# EAGLE design Qwiic_Iridium_9603N (EAGLE 9.6.2)
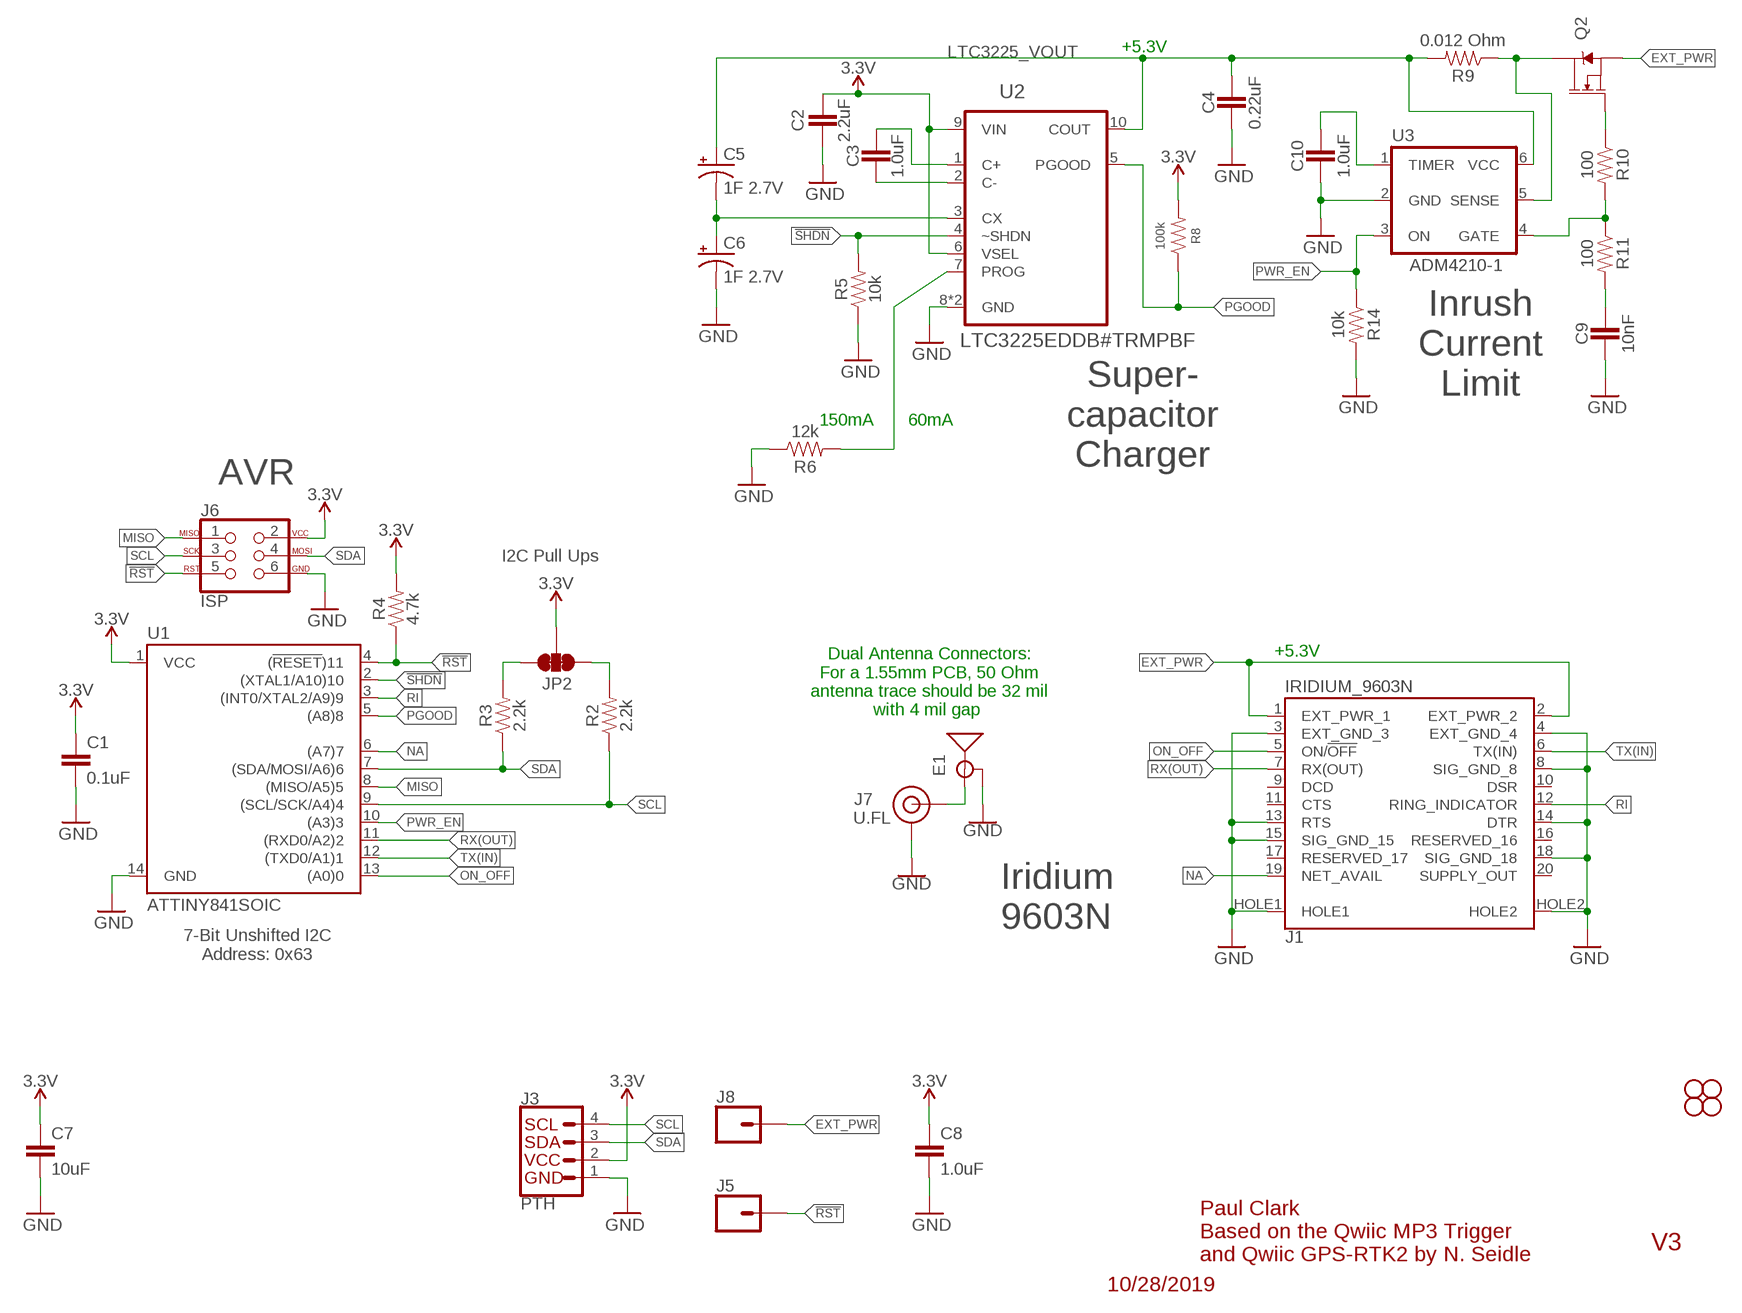
[diagram p0: schematic, sheet 1]

## Parts
C1  0.1uF  0.1UF-0603-25V-5%  [0603]
C2  2.2uF  2.2UF-0603-10V-20%  [0603]
C3  1.0uF  1.0UF-0603-16V-10%-X7R  [0603]
C4  0.22uF  0.22UF-0603-25V-10%  [0603]
C5  1F 2.7V  1F-2.7V(PTH)CPOL-RADIAL-1H-2.7V  [CPOL-RADIAL-1F-2.7V]
C6  1F 2.7V  1F-2.7V(PTH)CPOL-RADIAL-1H-2.7V  [CPOL-RADIAL-1F-2.7V]
C7  10uF  10UF-0603-6.3V-20%  [0603]
C8  1.0uF  1.0UF-0603-16V-10%-X7R  [0603]
C9  10nF  10NF-0603-50V-10%  [0603]
C10  1.0uF  1.0UF-0603-16V-10%-X7R  [0603]
E1  ANTENNA-GROUNDEDEDGE_SMA  [SMA-EDGE]
J1  IRIDIUM_9603N  [IRIDIUM_9603N]
J3  PTH  I2C_STANDARDJS-1MM  [1X04_1MM_RA]
J5  CONN_01PTH_NO_SILK_YES_STOP  [1X01_NO_SILK]
J6  ISP  AVR_SPI_PROG_3X2TESTPOINTS  [2X3_TEST_POINTS]
J7  U.FL  U.FL2PIN  [U.FL]
J8  CONN_01PTH_NO_SILK_YES_STOP  [1X01_NO_SILK]
JP2  JUMPER-SMT_3_2-NC_TRACE_SILK  [SMT-JUMPER_3_2-NC_TRACE_SILK]
JP3  STAND-OFF  [STAND-OFF]
JP4  STAND-OFF  [STAND-OFF]
JP9  STAND-OFF  [STAND-OFF]
JP10  STAND-OFF  [STAND-OFF]
Q2  5.8A/30V/35mΩ  MOSFET-NCH-AO3404A  [SOT23-3]
R2  2.2k  2.2KOHM-0603-1/10W-1%  [0603]
R3  2.2k  2.2KOHM-0603-1/10W-1%  [0603]
R4  4.7k  4.7KOHM-0603-1/10W-1%  [0603]
R5  10k  10KOHM-0603-1/10W-1%  [0603]
R6  12k  12KOHM-0603-1/10W-1%  [0603]
R8  100k  100KOHM-0603-1/10W-1%  [0603]
R9  0.012 Ohm  RESISTOR0603  [0603]
R10  100  100OHM-0603-1/10W-1%  [0603]
R11  100  100OHM-0603-1/10W-1%  [0603]
R14  10k  10KOHM-0603-1/10W-1%  [0603]
U1  ATTINY841SOIC  [ATTINY841]
U2  LTC3225EDDB#TRMPBF  LTC3225EDDB-TRMPBFDFN300X200-10L  [DFN300X200-10L]
U3  ADM4210-1  [TSOT6]

## Nets
3.3V [3.3V]: C1.1 C2.1 C7.1 C8.1 J3.2(VCC) J6.2 JP2.2 R4.2 R8.2 U1.1(VCC) U2.6(VSEL) U2.9(VIN)
!RST: J5.1 J6.5 R4.1 U1.4((!RESET!)11)
!SHDN: R5.2 U1.2((XTAL1/A10)10) U2.4(~SHDN)
EXT_PWR: J1.1(EXT_PWR_1) J1.2(EXT_PWR_2) J8.1 Q2.2(S)
GND: C1.2 C2.2 C4.2 C6.- C7.2 C8.2 C9.2 C10.2 E1.GND@0(GND) E1.GND@1(GND) E1.GND@2(GND) E1.GND@3(GND) J1.3(EXT_GND_3) J1.4(EXT_GND_4) J1.8(SIG_GND_8) J1.13(RTS) J1.14(DTR) J1.15(SIG_GND_15) J1.18(SIG_GND_18) J1.HOLE1 J1.HOLE2 J3.1(GND) J6.6 J7.1(GND) J7.2(GND) R5.1 R6.1 R14.2 U1.14(GND) U2.8(GND) U2.11(GND) U3.2(GND)
LTC3225_VOUT: C4.1 C5.+ R9.2 U2.10(COUT) U3.6(VCC)
MISO: J6.1 U1.8((MISO/A5)5)
N$1: C5.- C6.+ U2.3(CX)
N$2: R6.2 U2.7(PROG)
N$7: E1.SIG(SIGNAL) J7.FEED(SIGNAL)
N$8: Q2.3(D) R9.1 U3.5(SENSE)
N$9: C3.2 U2.2(C-)
N$10: C3.1 U2.1(C+)
N$12: Q2.1(G) R10.1
N$13: R10.2 R11.1 U3.4(GATE)
N$14: C9.1 R11.2
N$15: C10.1 U3.1(TIMER)
NA: J1.19(NET_AVAIL) U1.6((A7)7)
ON_OFF: J1.5(ON/!OFF!) U1.13((A0)0)
PGOOD: R8.1 U1.5((A8)8) U2.5(PGOOD)
PWR_EN: R14.1 U1.10((A3)3) U3.3(ON)
RI: J1.12(RING_INDICATOR) U1.3((INT0/XTAL2/A9)9)
RX(OUT): J1.7(RX(OUT)) U1.11((RXD0/A2)2)
SCL: J3.4(SCL) J6.3 R2.1 U1.9((SCL/SCK/A4)4)
SCL_PU1: JP2.1 R2.2
SDA: J3.3(SDA) J6.4 R3.1 U1.7((SDA/MOSI/A6)6)
SDA_PU1: JP2.3 R3.2
TX(IN): J1.6(TX(IN)) U1.12((TXD0/A1)1)
Unconnected: J1.9(DCD) J1.10(DSR) J1.11(CTS) J1.16(RESERVED_16) J1.17(RESERVED_17) J1.20(SUPPLY_OUT)

## Notes on the sheet
- +5.3V
- Inrush
  Current
  Limit
- 150mA | 60mA
- Super-
  capacitor
  Charger
- AVR
- I2C Pull Ups
- +5.3V
- Dual Antenna Connectors:
  For a 1.55mm PCB, 50 Ohm
  antenna trace should be 32 mil
  with 4 mil gap
- Iridium
  9603N
- 7-Bit Unshifted I2C
  Address: 0x63
- V3
- Paul Clark
  Based on the Qwiic MP3 Trigger
  and Qwiic GPS-RTK2 by N. Seidle
- 10/28/2019

## Library data of the parts
C1 = SparkFun-Capacitors:0.1UF: 0.1µF ceramic capacitors A capacitor is a passive two-terminal electrical component used to store electrical energy temporarily in an electric field.; PROD_ID: CAP-08604
C2 = SparkFun-Capacitors:2.2UF: 2.2µF ceramic capacitors A capacitor is a passive two-terminal electrical component used to store electrical energy temporarily in an electric field.; PROD_ID: CAP-07888
C3 C8 C10 = SparkFun-Capacitors:1.0UF: 1µF ceramic capacitors A capacitor is a passive two-terminal electrical component used to store electrical energy temporarily in an electric field.; PROD_ID: CAP-13930
C4 = SparkFun-Capacitors:0.22UF: 0.22µF ceramic capacitors A capacitor is a passive two-terminal electrical component used to store electrical energy temporarily in an electric field.; PROD_ID: CAP-07822
C5 C6 = SparkFun-Capacitors:1F-2.7V(PTH): CAP-08070
C7 = SparkFun-Capacitors:10UF: 10.0µF ceramic capacitors A capacitor is a passive two-terminal electrical component used to store electrical energy temporarily in an electric field.; PROD_ID: CAP-11015
C9 = SparkFun-Capacitors:10NF: 0.01uF/10nF/10,000pF ceramic capacitors A capacitor is a passive two-terminal electrical component used to store electrical energy temporarily in an electric field. CAP-09321; PROD_ID: CAP-00867
E1 = SparkFun-RF:ANTENNA-GROUNDED: Antenna w/ Ground Connection 2.4GHz antennae with signal and ground terminals. TRACE_ANTENNA_2.4GHZ_15.2MM - Meander Trace antenna 15.2 x 5.7mm footprint Based on layout from TI app note AN043 <http://www.ti.com/lit/an/swra117d/swra117d.pdf>. TRACE_ANTENNA_2.4GHZ_25.7MM - Inverted F trace antenna 25.7 x 7.5 mm footprint. Based on layout from TI design note DN0007 <http://www.ti.com/lit/an/swru120b/swru120b.pdf>.; PROD_ID: CONN-08289
J1 = Qwiic_Iridium_9603N:IRIDIUM_9603N: Iridium 9603N with two McMaster 95117A411 press-fit nuts
J3 = SparkX:I2C_STANDARD: SparkFun I2C Standard Pinout Header SparkFun has standardized on a pinout for all I2C based sensor breakouts. This pinout allows I2C boards to be plugged directly into the headers on Arduino Uno compatible boards, and to be daisy chained easily. Example SparkFun Products: SparkFun Atmospheric Sensor Breakout - BME280 <https://www.sparkfun.com/products/13676> SparkFun Altitude/Pressure Sensor Breakout - MPL3115A2 <https://www.sparkfun.com/products/11084> SparkFun TOF Range Finder Sensor - VL6180 <https://www.sparkfun.com/products/12785>
J5 J8 = SparkFun-Connectors:CONN_01: Single connection point. Often used as Generic Header-pin footprint for 0.1 inch spaced/style header connections On any of the 0.1 inch spaced packages, you can populate with these: Break Away Headers - Straight <https://www.sparkfun.com/products/116> (PRT-00116) Break Away Male Headers - Right Angle <https://www.sparkfun.com/products/553> (PRT-00553) Female Headers <https://www.sparkfun.com/products/115> (PRT-00115) Break Away Headers - Machine Pin <https://www.sparkfun.com/products/117> (PRT-00117) Break Away Female Headers - Swiss Machine Pin <https://www.sparkfun.com/products/743> (PRT-00743) This device is also useful as a general connection point to wire up your design to another part of your project. Our various solder wires solder well into these plated through hole pads. Hook-Up Wire - Assortment (Stranded, 22 AWG) <https://www.sparkfun.com/products/11375> (PRT-11375) Hook-Up Wire - Assortment (Solid Core, 22 AWG) <https://www.sparkfun.com/products/11367> (PRT-11367) View the entire wire category on our website here <https://www.sparkfun.com/categories/141> Special notes: SMTSO-256-ET is a "flush mount" nut for a 4-40 screw. We mostly use this on specialty testbeds; it is a nice way to connect hardware to your PCB at an adjustable hieght. Also note, the SNAP packages are for using a snappable style connector. We sell a baggie of snaps and they are also used on two LilyPad designs: Snap Assortment - 30 pack (male and female) <https://www.sparkfun.com/products/11347> (DEV-11347) LilyPad Arduino SimpleSnap <https://www.sparkfun.com/products/10941> (DEV-10941) LilyPad SimpleSnap Protoboard <https://www.sparkfun.com/products/10940> (DEV-10940)
J6 = SparkFun-Connectors:AVR_SPI_PROG_3X2: AVR ISP 6 Pin This is the reduced ISP connector for AVR programming. Common on Arduino. This footprint will take up less PCB space and can be used with a 10-pin to 6-pin adapter such as SKU: BOB-08508 **Special note about "TEST_POINT" package. The stop mask is on the top side, so if you want your programming test points to be on the bottom of your board, make sure to place this package on the bottom side of the board. This also ensure that the orientation to program from the bottom side will be correct. SparkFun Products: SparkFun ISP Pogo Adapter <https://www.sparkfun.com/products/11591> - NS Tiny AVR Programmer <https://www.sparkfun.com/products/11801> -PTH
J7 = SparkFun-Connectors:U.FL2PIN: SMD Antenna Connector - U.FL 2mm height, 3.0mm x 3.0mm receptacle size. SparkFun Products: SparkFun WiFi Shield - ESP8266 <https://www.sparkfun.com/products/13287> SparkFun ESP8266 Thing <https://www.sparkfun.com/products/13231> SparkFun MiniGen - Pro Mini Signal Generator Shield <https://www.sparkfun.com/products/11420>; PROD_ID: CONN-09193; SF_ID: WRL-09144
JP2 = SparkFun-Jumpers:JUMPER-SMT_3_2-NC_TRACE: Normally closed trace jumper (2 of 2 connections) This jumper has a trace between all three pads so they are normally closed (NC). Use a razor knife to open the connection(s). For best results follow the IPC guidelines for cutting traces: Cutout at least 0.063 mm (0.005 in). Remove all loose material to clean up the cut area. Seal the cut with an approved epoxy. Reapply solder to reclose the connection(s).
JP3 JP4 JP9 JP10 = SparkFun-Hardware:STAND-OFF: Stand Off Drill holes for mechanically mounting via screws, standoffs, etc. Note: Use the keepout ring to avoid running the screw head into surrounding components. Variant Overviews STAND-OFF - Mechanical footprint for a #4 phillips button head screw. STAND-OFF-TIGHT - Mechanical footprint for a #4 phillips button head screw, Example SparkFun Products Screw - Phillips Head (1/4", 4-40, 10 pack) <https://www.sparkfun.com/products/10453> (PRT-10453) Screw - Phillips Head (1/2", 4-40, 10 pack) <https://www.sparkfun.com/products/10452> (PRT-10452) Screw - Phillips Head (3/4", 4-40, 10 pack) <https://www.sparkfun.com/products/10451> (PRT-10451) Screw - Phillips Head (1", 4-40, 10 pack) <https://www.sparkfun.com/products/10450> (PRT-10450)
Q2 = SparkFun-DiscreteSemi:MOSFET-NCH: N-channel MOSFETs Voltage controlled devices that allow control of high current outputs. SparkFun Products: SparkFun OpenScale <https://www.sparkfun.com/products/13261> SparkFun Digital Sandbox <https://www.sparkfun.com/products/12651> SparkFun Monster Moto Shield <https://www.sparkfun.com/products/10182> SparkFun MOSFET Power Controller <https://www.sparkfun.com/products/11214>; PROD_ID: TRANS-12988
R2 R3 = SparkFun-Resistors:2.2KOHM: 2.2kΩ resistor A resistor is a passive two-terminal electrical component that implements electrical resistance as a circuit element. Resistors act to reduce current flow, and, at the same time, act to lower voltage levels within circuits. - Wikipedia; PROD_ID: RES-08272
R4 = SparkFun-Resistors:4.7KOHM: 4.7kΩ resistor A resistor is a passive two-terminal electrical component that implements electrical resistance as a circuit element. Resistors act to reduce current flow, and, at the same time, act to lower voltage levels within circuits. - Wikipedia; PROD_ID: RES-07857
R5 R14 = SparkFun-Resistors:10KOHM: 10kΩ resistor A resistor is a passive two-terminal electrical component that implements electrical resistance as a circuit element. Resistors act to reduce current flow, and, at the same time, act to lower voltage levels within circuits. - Wikipedia; PROD_ID: RES-00824
R6 = SparkFun-Resistors:12KOHM: 12kΩ resistor A resistor is a passive two-terminal electrical component that implements electrical resistance as a circuit element. Resistors act to reduce current flow, and, at the same time, act to lower voltage levels within circuits. - Wikipedia; PROD_ID: RES-10327
R8 = SparkFun-Resistors:100KOHM: 100kΩ resistor A resistor is a passive two-terminal electrical component that implements electrical resistance as a circuit element. Resistors act to reduce current flow, and, at the same time, act to lower voltage levels within circuits. - Wikipedia; PROD_ID: RES-07828
R9 = SparkFun-Resistors:RESISTOR: Generic Resistor Package
R10 R11 = SparkFun-Resistors:100OHM: 100Ω resistor A resistor is a passive two-terminal electrical component that implements electrical resistance as a circuit element. Resistors act to reduce current flow, and, at the same time, act to lower voltage levels within circuits. - Wikipedia; PROD_ID: RES-07863
U1 = Qwiic_Iridium_9603N:ATTINY841: The high-performance Microchip picoPower 8-bit AVR RISC-based microcontroller combines 8KB ISP flash memory, 512-Byte EEPROM, 512B SRAM, 12 general purpose I/O lines, 32 general purpose working registers, an 8-bit timer/counter with two PWM channels,??two 16-bit timer/counters with two PWM channels, internal and external interrupts, an 12-channel 10-bit A/D converter, 2 On-chip analog comparators, 2 full duplex USARTs with Start Frame wake up from power down, master/slave SPI serial interface, slave I2C serial interface, programmable gain stage (1x, 20x, and 100x) for 12 differential ADC channel pairs, programmable watchdog timer with internal oscillator, internal calibrated oscillator, and four software selectable power saving modes. The device operates between 1.7-5.5 volts.
U2 = Qwiic_Iridium_9603N:LTC3225EDDB-TRMPBF: 150mA Supercapacitor Charger
U3 = Qwiic_Iridium_9603N:ADM4210

## Net classes
1 3.3V: width 0.305 mm

## Board
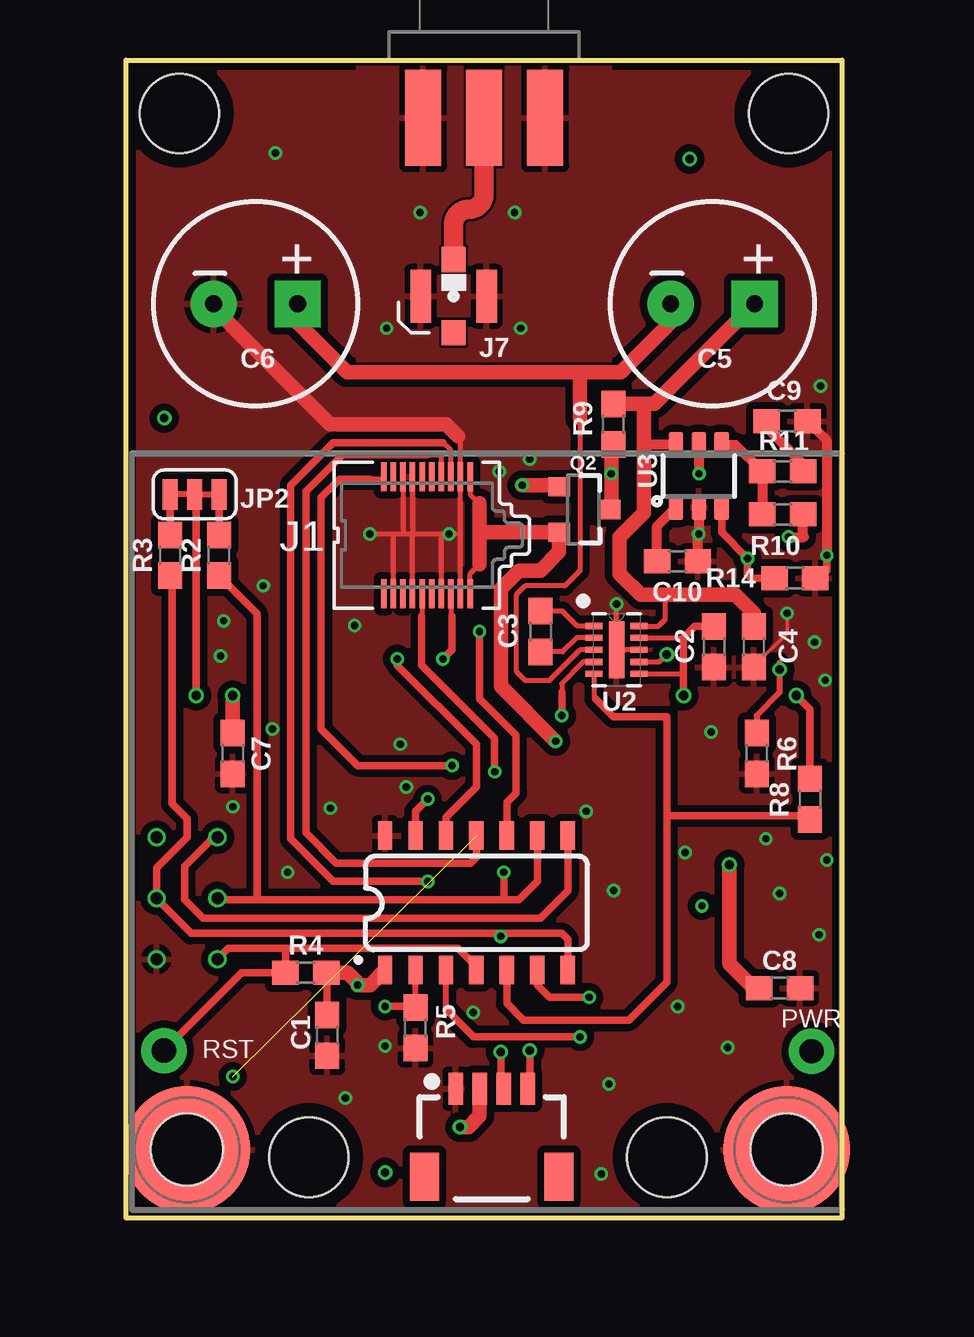
[diagram p1: board, top side]
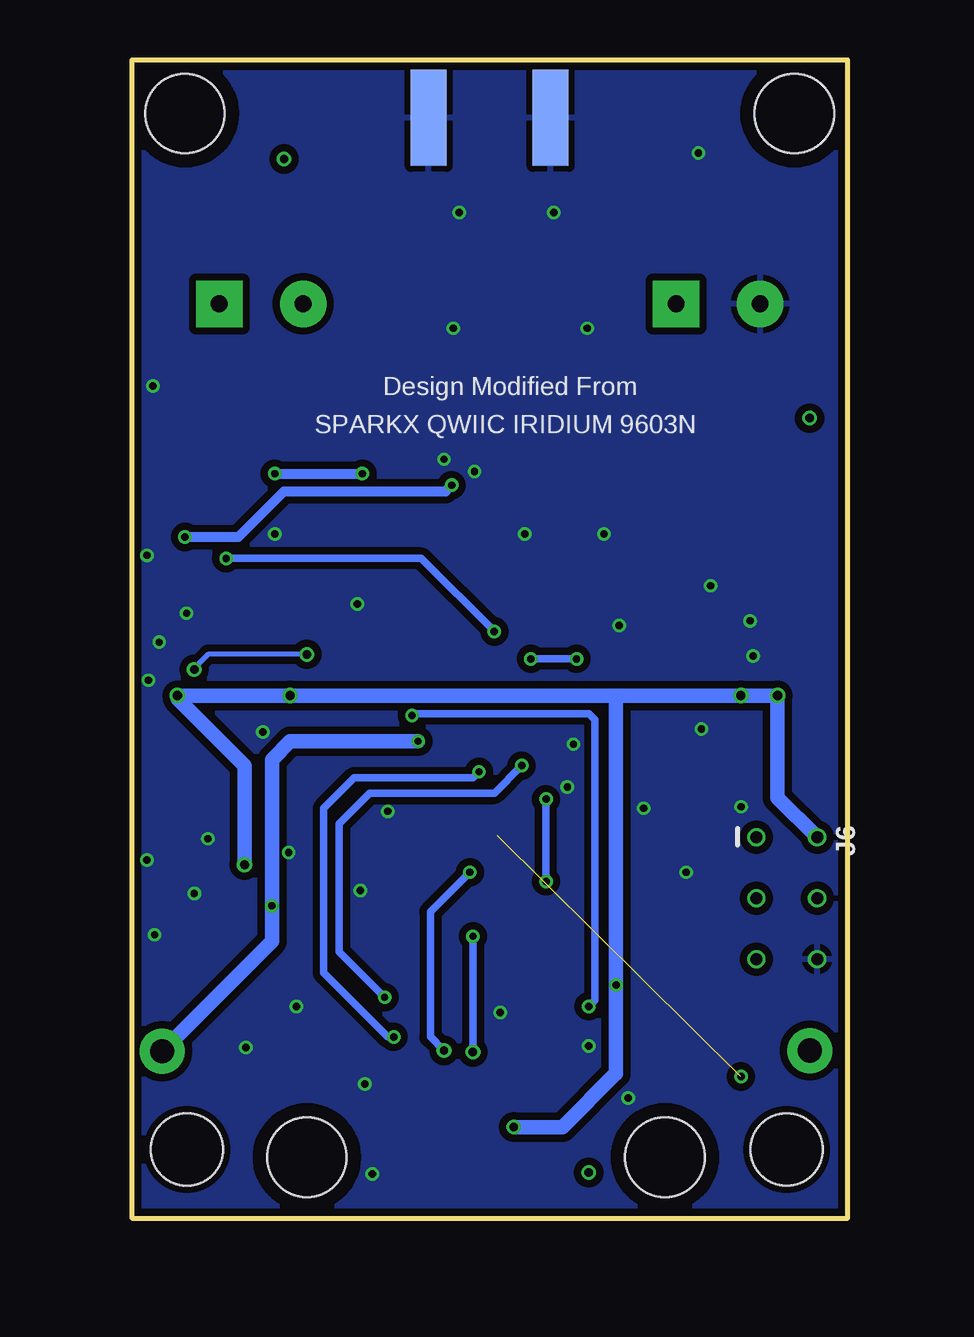
[diagram p2: board, bottom side, seen from below]

Size 29.85 x 48.26 mm. Coordinates in mm from the lower left corner, seen from the top.
Outline: 0,0 0,48.26 29.85,48.26 29.85,0 0,0
Copper layers (1*16): Top 0.035mm / dielectric 1.5mm / Bottom 0.035mm
Design rules "SparkFun-2-layer-FAB-LIMIT": minimum track width 4mil, minimum drill 6mil, track to track 4mil, track to pad 4mil, pad to pad 4mil, via to via 4mil, smd to smd 4mil, copper to edge 4mil, drill to drill 4mil, minimum pad ring 5mil, minimum via ring 5mil, stop-mask expansion 4mil, vias tented up to drill 25mil, thermal gap 10mil

### Footprints (pad centres in the part's own frame; a part is rotated, then mirrored left to right if it is on the bottom)
0603 = smd 1.1 x 1: 1 -0.85,0; 2 0.85,0
CPOL-RADIAL-1F-2.7V = drill 0.7 pad 1.93 square: + 1.75,0 | drill 0.7 pad 1.93: - -1.75,0
SMA-EDGE = smd 1.5 x 4: GND@0 -2.54,0; GND@1 2.54,0; SIG 0,0 | smd 1.5 x 4 bottom: GND@2 -2.54,0; GND@3 2.54,0
IRIDIUM_9603N = smd 0.23 x 1.2: 1 11.8,28.035; 2 11.8,23.165; 3 11.4,28.035; 4 11.4,23.165; 5 11,28.035; 6 11,23.165; 7 10.6,28.035; 8 10.6,23.165; 9 10.2,28.035; 10 10.2,23.165; 11 9.8,28.035; 12 9.8,23.165; 13 9.4,28.035; 14 9.4,23.165; 15 9,28.035; 16 9,23.165; 17 8.6,28.035; 18 8.6,23.165; 19 8.2,28.035; 20 8.2,23.165 | smd 5.3 x 5.3: HOLE1 0,0; HOLE2 25,0 | hole 3: 0,0; 25,0
1X04_1MM_RA = smd 0.6 x 1.35: 1 -1.5,0; 2 -0.5,0; 3 0.5,0; 4 1.5,0 | smd 1.2 x 2: NC1 2.8,-3.675; NC2 -2.8,-3.675
1X01_NO_SILK = drill 1.016 pad 1.88: 1 0,0
2X3_TEST_POINTS = drill 0.508: 1 -2.54,-1.27; 2 -2.54,1.27; 3 0,-1.27; 4 0,1.27; 5 2.54,-1.27; 6 2.54,1.27
U.FL = smd 2.2 x 0.85: 1 0,1.375; 2 0,-1.375 | smd 1.05 x 1: FEED 1.525,0; NC -1.525,0
SMT-JUMPER_3_2-NC_TRACE_SILK = smd 0.635 x 1.27: 1 -1.016,0; 2 0,0; 3 1.016,0
STAND-OFF = hole 3.302: 0,0
SOT23-3 = smd 0.8 x 0.9: 1 -0.95,-1; 2 0.95,-1; 3 0,1.1
ATTINY841 = smd 0.6 x 1.2: 1 -3.175,-2.8; 2 -1.905,-2.8; 3 -0.635,-2.8; 4 0.635,-2.8; 5 1.905,-2.8; 6 3.175,-2.8; 7 4.445,-2.8; 8 4.445,2.8; 9 3.175,2.8; 10 1.905,2.8; 11 0.635,2.8; 12 -0.635,2.8; 13 -1.905,2.8; 14 -3.175,2.8
DFN300X200-10L = smd 0.711 x 0.254: 1 -0.94,0.991; 2 -0.94,0.508; 3 -0.94,0; 4 -0.94,-0.508; 5 -0.94,-0.991; 6 0.94,-0.991; 7 0.94,-0.508; 8 0.94,0; 9 0.94,0.508; 10 0.94,0.991 | smd 0.635 x 2.388: 11 0,0
TSOT6 = smd 0.6 x 1.05: 1 -0.95,-1.3; 2 0,-1.3; 3 0.95,-1.3; 4 0.95,1.3; 5 0,1.3; 6 -0.95,1.3

### Placement (x,y rotation side)
C1  8.38,7.62 270 top
C2  24.51,23.81 270 top
C3  17.27,24.45 270 top
C4  26.16,23.81 270 top
C5  24.45,38.1 0 top
C6  5.4,38.1 0 top
C7  4.45,19.37 270 top
C8  27.24,9.59 0 top
C9  27.56,33.21 0 top
C10  22.99,27.37 0 top
E1  14.92,45.85 0 top
J1  2.54,2.86 0 top
J3  15.24,5.4 0 top
J5  1.57,6.99 0 top
J6  2.54,13.34 270 bottom
J7  13.65,38.42 90 top
J8  28.57,6.96 0 top
JP2  2.86,30.16 180 top
JP3  2.22,46.04 0 top
JP4  27.62,46.04 0 top
JP9  22.54,2.54 0 top
JP10  7.62,2.54 0 top
Q2  19.05,29.53 270 top
R2  3.87,27.62 90 top
R3  1.84,27.62 90 top
R4  7.49,10.22 0 top
R5  12.07,7.94 90 top
R6  26.29,19.37 90 top
R8  28.51,17.46 90 top
R9  20.32,33.08 90 top
R10  27.37,29.34 180 top
R11  27.37,31.12 0 top
R14  27.88,26.67 0 top
U1  13.97,13.14 0 top
U2  20.45,23.69 0 top
U3  23.88,30.92 0 top

### Tracks (layer width: path | path; a pad name or v marks a point on that pad's centre or on a via)
3.3V  (via drill 0.3, 0.35 pad 0.61, 0.38)
  Top 0.203: U2.9 23.24,24.19 | U2.6 23.22,22.69
  Top 0.305: C1.1 8.38,10.18 R4.2 | JP2.2 2.91,30.11 2.91,21.79 v2.92,21.78 | C2.1 23.71,24.66 23.24,24.19 23.24,22.67 | 23.24,22.67 v23.24,21.78 | 23.22,22.69 23.24,22.67 | R8.2 28.51,21.21 v27.94,21.78 | 25.07,14.73 v25.15,14.73
  Top 0.61: R4.2 9.23,10.22 9.65,9.8 v9.65,9.72 10.17,9.72 U1.1 | C7.1 v4.45,21.78 | C8.1 26.16,9.59 25.15,10.6 v25.15,14.73 | v13.92,3.8 14.27,3.8 14.74,4.26 J3.2
  Bottom 0.61: v25.15,14.73 25.15,18.86 27.94,21.65 v27.94,21.78 v23.24,21.78 9.65,21.78 | 9.65,21.78 v4.45,21.78 v2.92,21.78 2.92,17.53 J6.2 | 9.65,21.78 v9.65,9.72 9.65,6.03 9.66,6.03 11.89,3.8 v13.92,3.8
!RST
  Top 0.305: 6.64,11.24 4.25,11.24 J6.5 | 6.64,11.24 R4.1 4.81,10.22 J5.1 | 6.64,11.24 13.84,11.24 14.61,10.48 U1.4
!SHDN  (via drill 0.3)
  Top 0.203: U2.4 19.05,23.18 18.16,22.29 18.16,21.91
  Top 0.254: R5.2 U1.2
  Top 0.305: R5.2 12.03,8.83 v10.79,8.83 | v18.16,20.95 18.16,21.91
  Bottom 0.305: v10.79,8.83 10.54,9.08 10.54,20.76 10.79,21.02 18.09,21.02 v18.16,20.95
EXT_PWR  (via drill 0.3)
  Top 0.203: 14.34,30.17 14.73,29.78 | 14.73,27.24 14.34,26.85 14.34,26.12 J1.2 | J1.1 14.34,30.17 | 14.34,30.17
  Top 0.61: 14.73,29.78 14.73,28.51 | 14.73,28.51 14.73,27.24 | v17.91,19.88 15.62,22.16 15.62,26.23 16.38,26.99 17.27,26.99 18.05,27.77 Q2.2 14.8,28.58 14.73,28.51
  Bottom 0.61: v17.91,19.88 23.24,19.88 24,19.11 v24,13.02 24,11.53 J8.1
GND  (via drill 0.3)
  Top 0.152: v27.56,25.21 27.56,24.38 26.35,23.18
  Top 0.203: 13.84,32.58 13.94,32.48 J1.3 13.94,28.51 | J1.4 13.94,28.51 | 13.94,28.51 v13.46,28.51 13.21,28.51 | v10.16,28.51 11.18,28.51 | 11.18,28.51 11.56,28.51 | 11.56,28.51 11.94,28.51 | 11.94,28.51 13.21,28.51 | J1.15 11.54,28.53 11.56,28.51 | J1.13 11.94,28.51 | J1.18 11.14,28.48 11.18,28.51 | J1.14 11.94,28.51 | J1.8 13.14,28.44 13.21,28.51 | U2.8 U2.11 v20.45,25.59
  Top 0.305: v29.21,27.62 29.21,26.99 28.89,26.67 R14.2 | C4.2 26.16,22.99 26.35,23.18
  Top 0.406: U3.2 v23.88,28.51 23.84,28.47 C10.2 | C9.2 29.21,32.41 v29.21,27.62
  Top 0.61: 13.84,32.58 13.34,33.08 8.51,33.08 3.65,37.95 C6.- 3.56,38.01
  other vias: 10.79,7.18 20.13,5.59 4.45,17.14 4.06,24.89 28.7,24 26.67,15.81 25.08,7.11 8.51,17.08 11.68,17.97 6.73,14.41 12.26,41.91 16.19,41.91 16.45,37.08 15.56,31.12 11.43,19.75 9.52,24.7 5.71,26.35 23.3,15.24 22.99,8.83 19.81,1.84 9.14,5.02 29.15,22.42 3.94,23.43 10.86,37.08 16.83,31.62 6.1,20.38 24.38,20.26 14.48,8.57 19.18,16.95 20.32,13.65 6.22,44.39 28.96,34.67 29.21,14.92 28.89,11.81 27.24,13.53
  pour Bottom (isolate 0.305, rank 2): 0,0 0,48.26 29.85,48.26 29.85,0
  pour Top (isolate 0.305, rank 2): 0,0 0,48.26 29.85,48.26 29.85,0
  pour Top (isolate 0.102): 9.72,35.56 9.72,49.21 20.13,49.21 20.13,35.56
LTC3225_VOUT
  Top 0.203: U2.10 22.2,24.68 22.48,24.96 22.48,25.97
  Top 0.406: U3.6 21.62,32.22 21.59,32.19
  Top 0.61: 26.86,37.44 C5.+ 22.03,33.93 21.59,33.93 | C4.1 26.16,25.21 25.4,25.97 22.48,25.97 21.46,25.97 20.57,26.86 20.57,28.38 21.59,29.4 21.59,32.19 21.59,33.93 | 21.59,33.93 R9.2
MISO
  Top 0.305: J6.1 3.66,15.87 2.45,14.67 2.45,13.27 3.21,12.51 17.27,12.51 18.41,13.65 U1.8
N$1
  Top 0.203: U2.3 18.92,23.69 17.65,22.42 16.64,22.42 16.26,22.8 16.26,25.97 16.64,26.35 18.29,26.35 18.92,26.99 18.92,33.34 18.92,33.4
  Top 0.61: C5.- 22.7,37.3 20.64,35.24 19.05,35.24 18.92,35.12 | 18.92,35.12 18.92,35.24 9.21,35.24 7.15,37.3 C6.+ | 18.92,35.12 18.92,33.34
N$2  (via drill 0.35 pad 0.61)
  Top 0.203: v22.54,23.49 22.22,23.18 U2.7 | v27.24,22.86 27.24,23.18
  Top 0.254: v27.24,22.86 27.24,21.91 26.29,20.96 R6.2
  Bottom 0.203: v22.54,23.49 26.67,23.49 27.31,22.86 v27.24,22.86
N$3  (via drill 0.35)
  other vias: 23.5,44.13
N$4  (via drill 0.35)
  other vias: 1.59,33.34
N$5  (via drill 0.35)
  other vias: 10.79,1.91
N$7
  Top 0.813: J7.FEED 13.65,41.4 arc-90 14.29,42.04 arc90 14.92,42.67 E1.SIG
N$8  (via drill 0.3)
  Top 0.406: U3.5 v23.88,31.03 v23.88,31.02
  Top 0.61: R9.1 20.23,32.14 v20.23,31.02 20.23,29.6 Q2.3
  Bottom 0.406: v23.88,31.02 v20.23,31.02
N$9
  Top 0.203: U2.2 18.8,24.19 18.2,23.6 C3.2
N$10
  Top 0.203: U2.1 18.82,24.68 18.2,25.3 C3.1
N$12  (via drill 0.3)
  Top 0.406: v27.62,28.38 28.26,28.38 28.22,28.42 R10.1
  Top 0.61: Q2.1 17.98,30.54 v16.51,30.54
  Bottom 0.406: v16.51,30.54 16.76,30.29 23.5,30.29 25.4,28.38 v27.62,28.38
N$13
  Top 0.406: U3.4 25.41,32.22 R11.1 R10.2
N$14
  Top 0.406: C9.1 26.71,32.94 28.22,31.43 R11.2
N$15
  Top 0.406: C10.1 22.14,28.84 U3.1
NA  (via drill 0.3)
  Top 0.203: J1.19 10.64,30.8 10.16,30.8
  Top 0.254: 17.14,9.72 U1.6
  Top 0.305: v19.3,9.21 17.65,9.21 17.14,9.72 | 10.16,30.8 8.89,30.8 8.13,30.04 8.13,20.38 9.65,18.86 v13.59,18.86
  Bottom 0.305: v13.59,18.86 14.73,17.72 19.94,17.72 21.21,16.45 21.21,11.11 v19.3,9.21
ON_OFF  (via drill 0.3)
  Top 0.203: 13.21,32.32 13.54,31.99 13.54,30.79 J1.5
  Top 0.305: 13.21,32.32 8.64,32.32 6.86,30.54 6.86,15.81 8.64,14.03 v12.57,14.03 | v12.57,17.46 12.07,16.95 U1.13
  Bottom 0.305: v12.57,14.03 v12.57,17.46
PGOOD
  Top 0.203: U2.5 19.51,21.7 19.56,21.65
  Top 0.305: 19.56,21.65 20.32,20.89 22.54,20.89 22.54,16.76 | 22.54,16.76 28.36,16.76 R8.1 | U1.5 15.88,8.95 16.57,8.25 20.95,8.25 22.54,9.84 22.54,16.76
PWR_EN  (via drill 0.3)
  Top 0.305: v14.73,24.45 14.73,21.65 16.26,20.13 16.26,17.72 15.88,17.34 U1.10 | U3.3 24.83,28.58 v25.91,27.5 25.91,26.84 26.07,26.67 R14.1
  Bottom 0.305: v14.73,24.45 17.78,27.5 v25.91,27.5
RI  (via drill 0.3)
  Top 0.203: J1.12 12.34,25.1 12.32,25.08
  Top 0.254: 13.34,8.7 U1.3
  Top 0.305: 12.32,25.08 12.32,23.05 15.37,20 v15.37,18.61 | v18.92,7.56 14.48,7.56 13.34,8.7
  Bottom 0.305: v15.37,18.61 15.62,18.35 20.57,18.35 21.84,17.08 21.84,10.22 19.18,7.56 v18.92,7.56
RX(OUT)  (via drill 0.3)  (1 unrouted)
  Top 0.203: 12.57,31.81 13.03,31.81 13.14,31.71 13.14,30.79 J1.7
  Top 0.305: 12.57,31.81 9.02,31.81 7.49,30.29 7.49,16.07 8.76,14.8 14.35,14.8 14.61,15.05 U1.11
  other vias: 4.45,5.91
SCL  (via drill 0.3, 0.35 pad 0.61)
  Top 0.305: 15.75,13.27 16.38,13.27 17.14,14.03 U1.9 | R2.1 5.46,25.19 5.46,13.27 | v15.75,14.41 15.75,13.27 | J3.4 16.83,5.49 v16.83,6.99 | 15.75,13.27 5.46,13.27 | 5.46,13.27 3.87,13.27 J6.3
  Bottom 0.305: v15.75,14.41 17.4,12.76 17.4,7.56 v16.83,6.99
SCL_PU1
  Top 0.305: R2.2 JP2.1
SDA  (via drill 0.3, 0.35 pad 0.61)
  Top 0.305: 15.62,11.87 2.7,11.87 1.27,13.31 J6.4 1.27,14.6 2.54,15.87 2.54,16.65 1.91,17.28 1.91,26.7 R3.1 | 15.62,11.87 18.16,11.87 18.41,11.62 U1.7 | 15.62,11.87 v15.62,11.75 | v15.62,6.92 15.62,5.52 J3.3
  Bottom 0.305: v15.62,11.75 v15.62,6.92
SDA_PU1
  Top 0.305: JP2.3 R3.2
TX(IN)  (via drill 0.3)
  Top 0.203: J1.6 13.54,25.13 13.59,25.08
  Top 0.305: v13.21,23.3 13.59,23.69 13.59,25.08 | v11.3,23.3 11.3,23.05 14.61,19.75 14.61,17.97 13.34,16.7 U1.12
  Bottom 0.305: v11.3,23.3 v13.21,23.3

### Text on the board
tPlace: + | + | PWR | RST
bPlace: Design Modified From | SPARKX QWIIC IRIDIUM 9603N